# Altium schematic sheet CurrentSense.SchDoc
size A
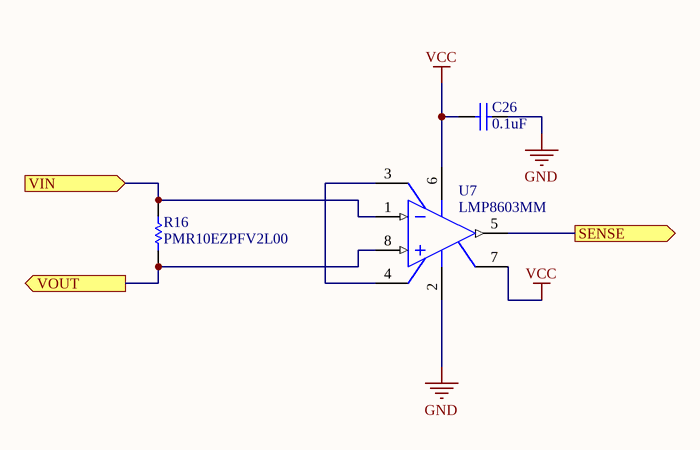
[diagram p0: CurrentSense.SchDoc]

## Parts
C26  0.1uF  [CAPC0603(1608)100_L]
R16  PMR10EZPFV2L00  [0805-SHUNT]
U7  LMP8603MM  [MUA08A_N]

## Ports
SENSE (out), VIN (in), VOUT (out)

## Nets
GND: C26.2 U7.2(GND)
VCC: C26.1 U7.6(VS) U7.7(OFS)
SENSE: U7.5(OUT) ; port SENSE
VIN: R16.2 U7.1(IN-) ; port VIN
VOUT: R16.1 U7.8(IN+) ; port VOUT
NetU7_3: U7.3(A1) U7.4(A2)

## Library data of the parts
C26 = CMP-1035-02595-1: CAP 100nF 100V ±10% 0603 (1608 Metric) Thickness 1mm SMD; Tolerance: Â±10%; Case-EIA: 0603; Case-Metric: 1608; Rated Voltage: 100 V; Value: 100nF; Technology: SMT; Max Thickness: 1 mm
U7 = CMP-0055-01495-2: 60V Common Mode, 100 x Gain, Bidirectional Precision Current Sensing Amplifier, 8-pin Mini SOIC; Manufacturer: National Semiconductor; PowerWise: N; CompType: Amplifiers; PackageTopMarking: ZXTT*AP3A; RoHS: Y; ComponentLink2URL: http://www.national.com/pf/LM/LMP8603.html; ComponentLink2Description: LMP8603 Web Page; ComponentLink1Description: LMP8602 Datasheet; PackageDescription: MINI SOIC, .118 x .118 x .034in, 8 Lead, .0256in Pitch; ComponentLink3URL: http://www.national.com/packaging/folders/mua08a.html; DatasheetVersion: Mar-2010; Code_JEDEC: MO-187-AA; ComponentLink3Description: MUA08A Package Page; ComponentLink1URL: http://www.national.com/ds/LM/LMP8602.pdf; RevisionNote: Component URLs added; PackageVersion: revF, Apr-2008; PinCount: 8; PackageReference: MUA08A